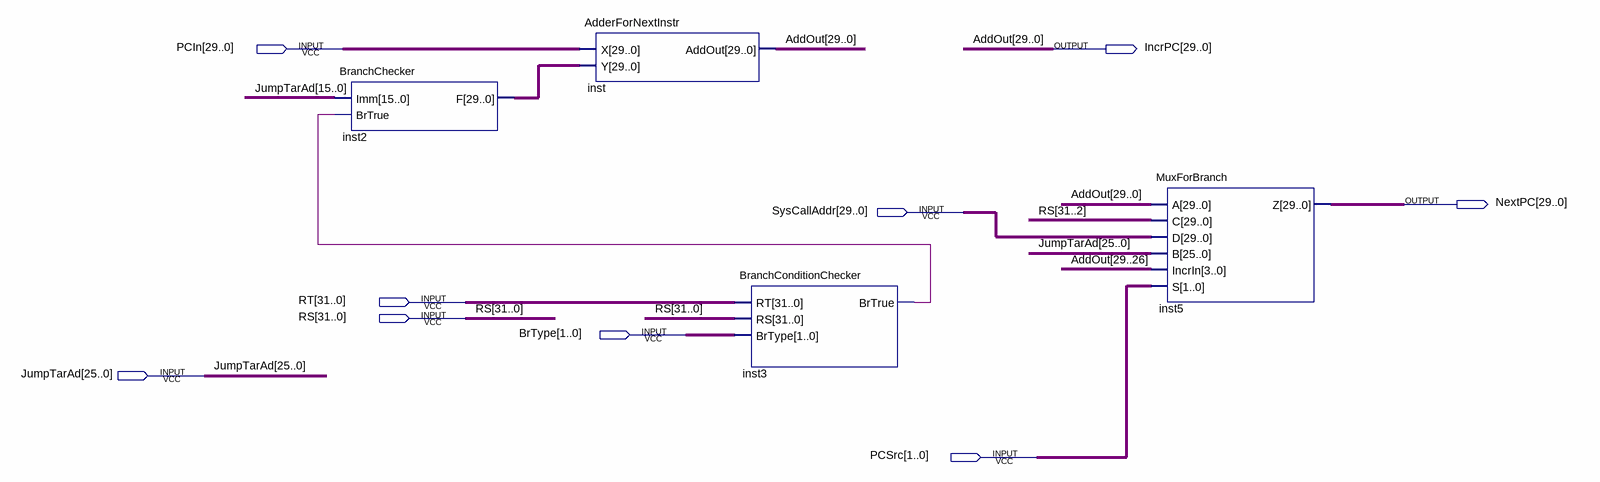
[diagram p0: schematic sheet]
// Quartus schematic NextAddressBlock.bdf as structural Verilog: 4 symbols, 9 pins
module NextAddressBlock (
  input  [29:0] PCIn,
  input  [29:0] SysCallAddr,
  input  [31:0] RT,
  input  [31:0] RS,
  input  [1:0] BrType,
  input  [25:0] JumpTarAd,
  input  [1:0] PCSrc,
  output [29:0] IncrPC,
  output [29:0] NextPC
);

  wire inst3_brtrue;
  wire [29:0] inst2_f;

  BranchChecker inst2 (.Imm(JumpTarAd[15:0]), .BrTrue(inst3_brtrue), .F(inst2_f));
  AdderForNextInstr inst (.X(PCIn), .Y(inst2_f), .AddOut(IncrPC));
  BranchConditionChecker inst3 (.RT(RT), .RS(RS), .BrType(BrType), .BrTrue(inst3_brtrue));
  MuxForBranch inst5 (
    .A(IncrPC), .C(RS[31:2]), .D(SysCallAddr), .B(JumpTarAd), .IncrIn(IncrPC[29:26]), .S(PCSrc), .Z(NextPC));

  // Other names for the same wires on the sheet: AddOut[29:0] = IncrPC
endmodule
